# Altium schematic sheet Sheet1.SchDoc
size A2
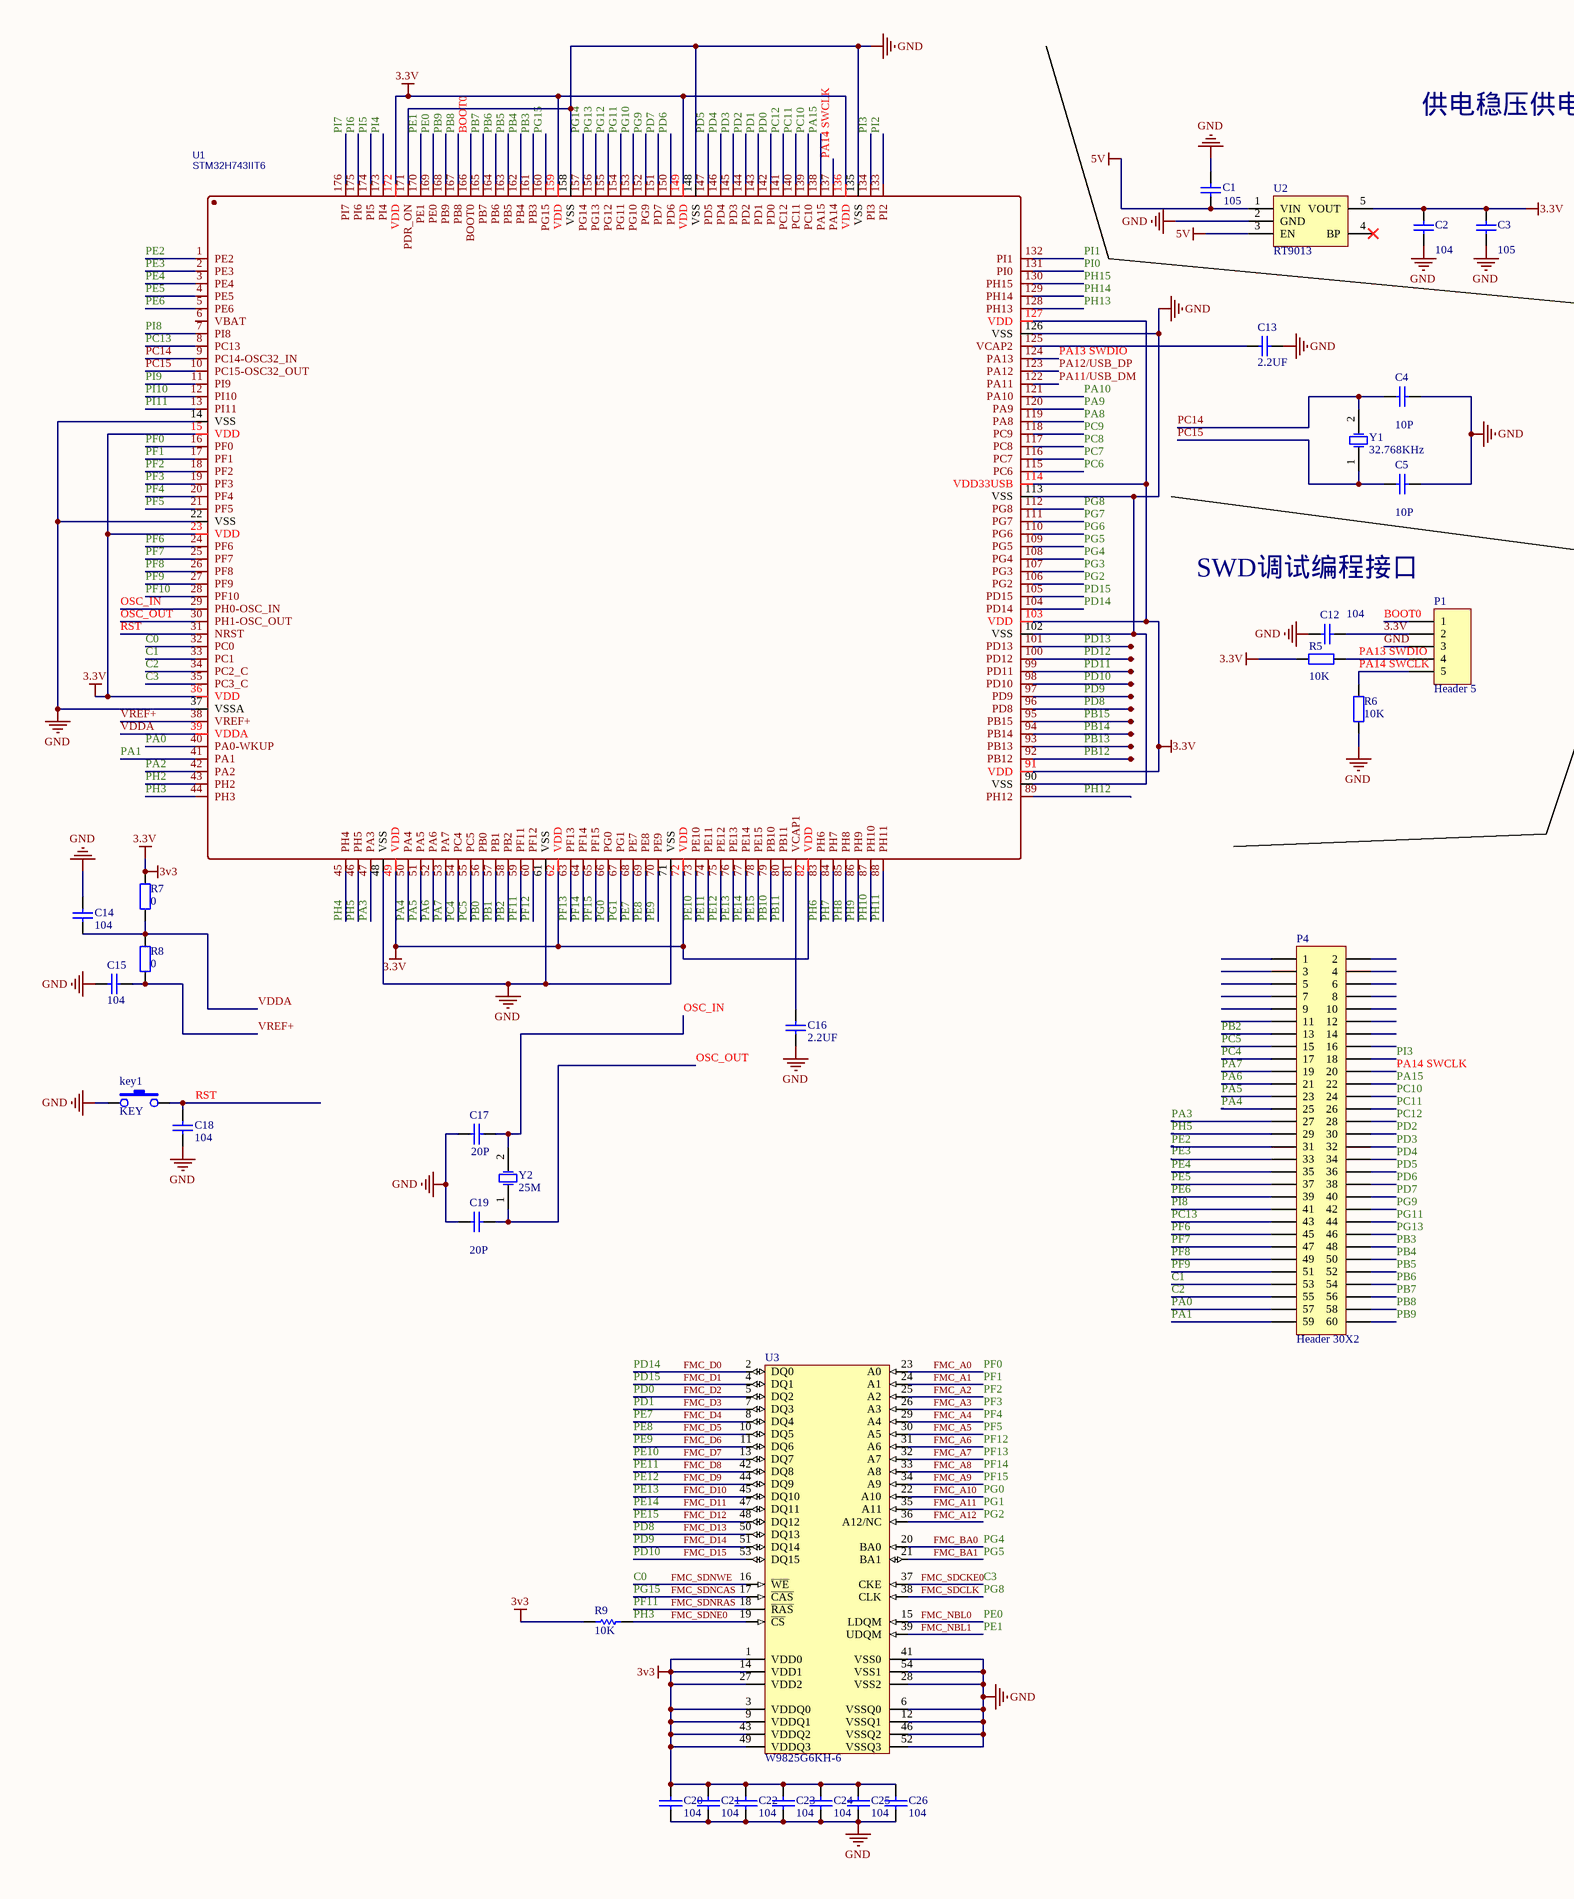
[diagram p0: Sheet1.SchDoc, left]
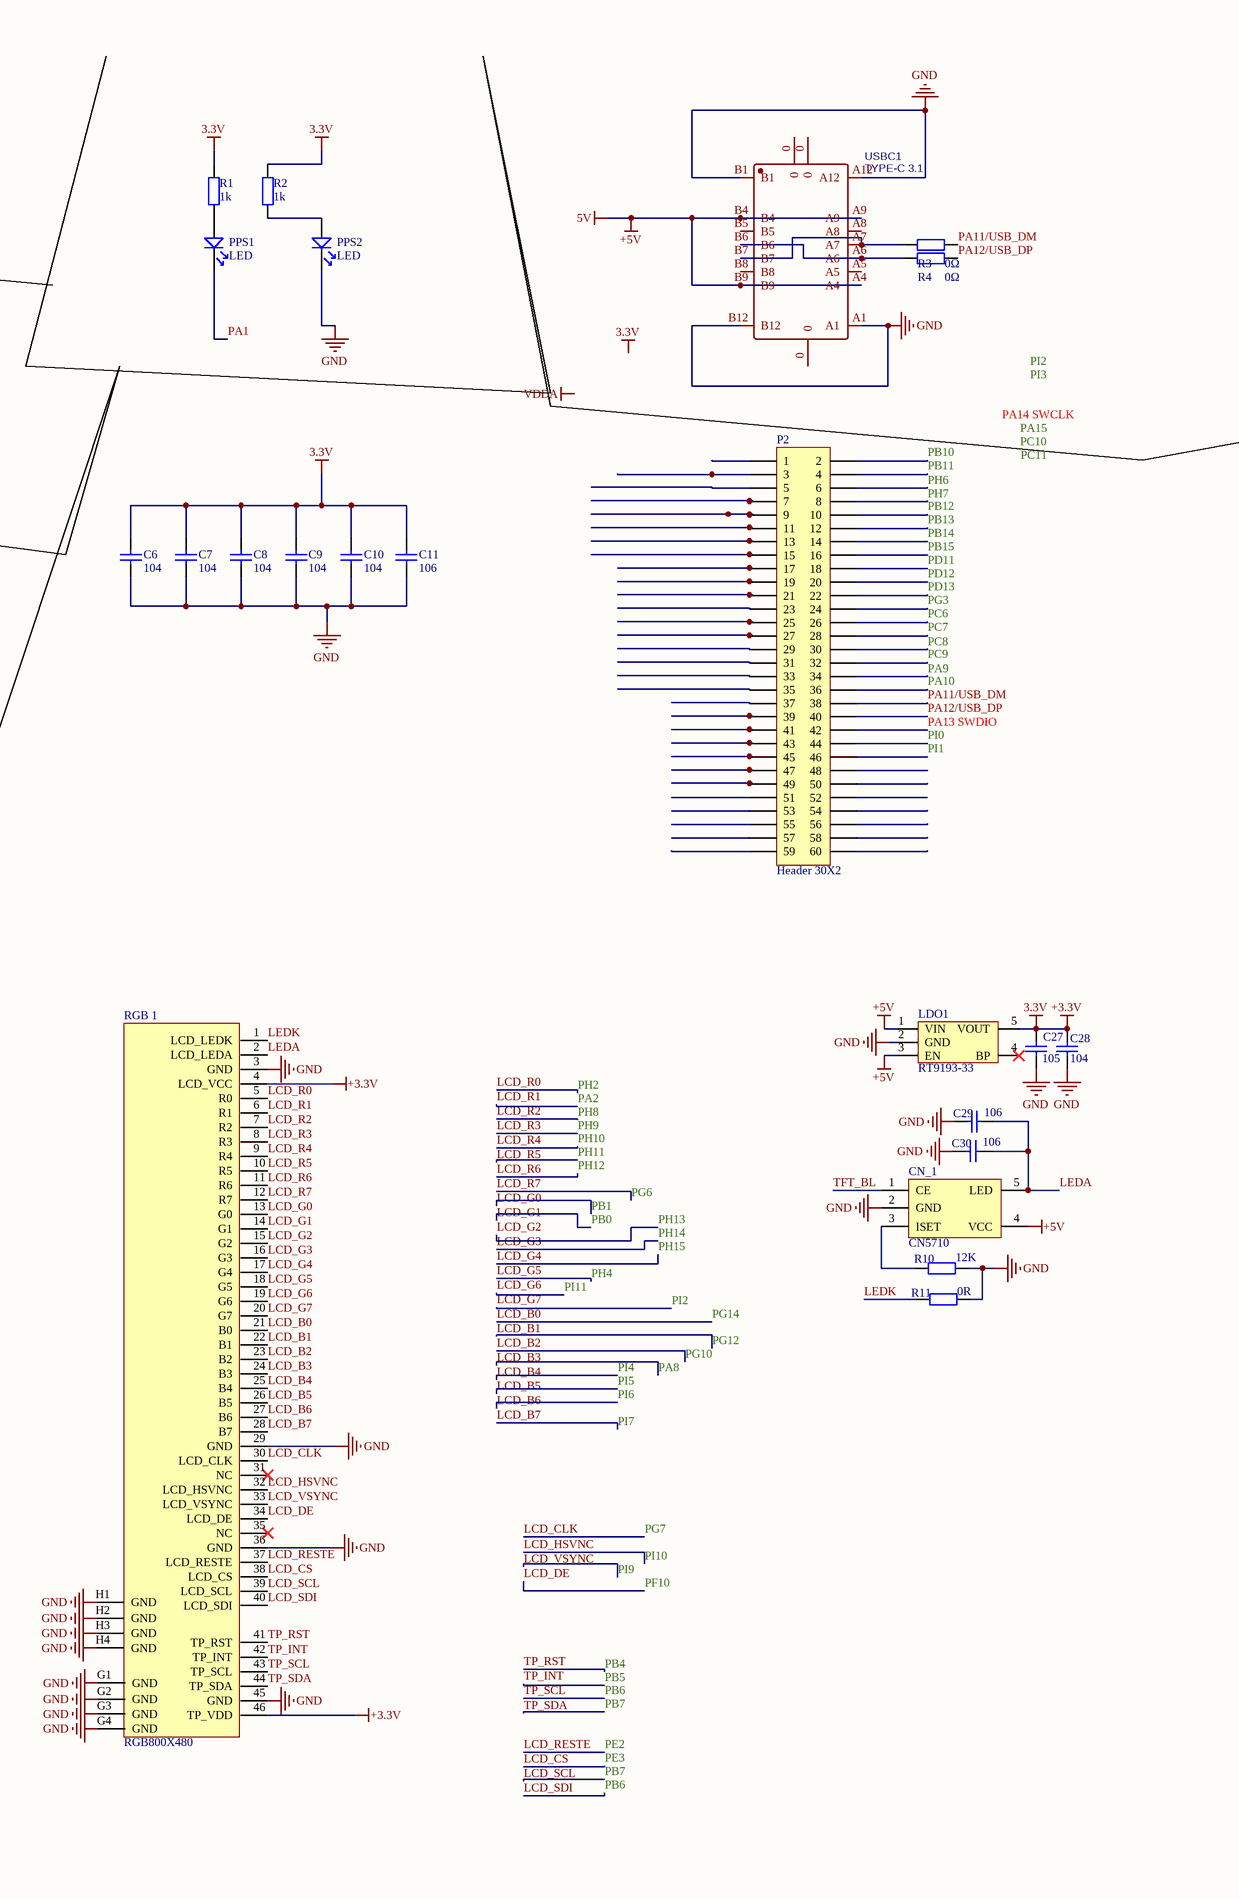
[diagram p1: Sheet1.SchDoc, right]

## Parts
C1  value 105  [0805C]  (hidden comment: Cap Semi)
C2  value 104  [0805C]  (hidden comment: Cap Semi)
C3  value 105  [0805C]  (hidden comment: Cap Semi)
C4  value 10P  [0805C]
C5  value 10P  [0805C]
C6  value 104  [0805C]
C7  value 104  [0805C]
C8  value 104  [0805C]
C9  value 104  [0805C]
C10  value 104  [0805C]
C11  value 106  [0805C]
C12  value 104  [0805C]
C13  value 2.2UF  [0805C]
C14  value 104  [0805C]
C15  value 104  [0805C]
C16  value 2.2UF  [0805C]
C17  value 20P  [0805C]
C18  value 104  [0805C]
C19  value 20P  [0805C]
C20  104  [0805C]
C21  104  [0805C]
C22  104  [0805C]
C23  104  [0805C]
C24  104  [0805C]
C25  104  [0805C]
C26  104  [0805C]
C27  105  [0805C]
C28  104  [0805C]
C29  106  [0805C]
C30  106  [0805C]
CN_1  CN5710  [LC-SOT-89-5]
key1  KEY  [TSW 3*6*4.3-S-W]
LDO1  RT9193-33  [SOT-23-5]
P1  Header 5  [HDR2.54-WS-5P]
P2  Header 30X2  [BTB60]
P4  Header 30X2  [BTB60]
PPS1  LED  [LED 0805G]
PPS2  LED  [LED 0805G]
R1  1k  [0805R]
R2  1k  [0805R]
R3  0Ω  [0805R]
R4  0Ω  [0805R]
R5  10K  [0805R]
R6  10K  [0805R]
R7  0  [0805R]
R8  0  [0805R]
R9  10K  [0805R]
R10  12K  [0805R]
R11  0R  [0805R]
RGB_1  RGB800X480  [RGB_800x480]
U1  STM32H743IIT6  [LQFP176 24x24_M]
U2  RT9013  [SOT23-5]
U3  W9825G6KH-6  [SOP80P1176X120-54N]
USBC1  TYPE-C 3.1  [TYPE-C-USB-17]
Y1  32.768KHz  [OSC 3215-2P]
Y2  25M  [OSC 5032-2P]

## Nets
3.3V: C2.2 C3.2 C6.1 C7.1 C8.1 C9.1 C10.1 C11.1 C12.1 C20.2 C21.2 C22.2 C23.2 C24.2 C25.2 C26.2 C27.2 C28.2 LDO1.5(VOUT) P1.2 R1.2 R2.2 R5.1 R7.1 R9.1 RGB_1.4(LCD_VCC) RGB_1.46(TP_VDD) U1.15(VDD) U1.23(VDD) U1.36(VDD) U1.49(VDD) U1.62(VDD) U1.72(VDD) U1.82(VDD) U1.91(VDD) U1.103(VDD) U1.114(VDD33USB) U1.127(VDD) U1.136(VDD) U1.149(VDD) U1.159(VDD) U1.172(VDD) U2.5(VOUT) U3.1(VDD0) U3.3(VDDQ0) U3.9(VDDQ1) U3.14(VDD1) U3.27(VDD2) U3.43(VDDQ2) U3.49(VDDQ3)  [also labelled +3.3V, 3v3]
+5V: C1.1 CN_1.4(VCC) LDO1.1(VIN) LDO1.3(EN) U2.1(VIN) U2.3(EN) USBC1.A4 USBC1.A9 USBC1.B4 USBC1.B9  [also labelled 5V]
GND: C1.2 C2.1 C3.1 C4.1 C5.1 C6.2 C7.2 C8.2 C9.2 C10.2 C11.2 C12.2 C13.2 C14.1 C15.2 C16.2 C17.2 C18.1 C19.2 C20.1 C21.1 C22.1 C23.1 C24.1 C25.1 C26.1 C27.1 C28.1 C29.2 C30.2 CN_1.2(GND) key1.1 LDO1.2(GND) P1.3 PPS2.2 R6.1 R10.1 R11.2 RGB_1.3(GND) RGB_1.29(GND) RGB_1.36(GND) RGB_1.45(GND) RGB_1.G1(GND) RGB_1.G2(GND) RGB_1.G3(GND) RGB_1.G4(GND) RGB_1.H1(GND) RGB_1.H2(GND) RGB_1.H3(GND) RGB_1.H4(GND) U1.14(VSS) U1.22(VSS) U1.37(VSSA) U1.48(VSS) U1.61(VSS) U1.71(VSS) U1.90(VSS) U1.102(VSS) U1.113(VSS) U1.126(VSS) U1.135(VSS) U1.148(VSS) U1.158(VSS) U1.171(PDR_ON) U2.2(GND) U3.6(VSSQ0) U3.12(VSSQ1) U3.28(VSS2) U3.41(VSS0) U3.46(VSSQ2) U3.52(VSSQ3) U3.54(VSS1) USBC1.A1 USBC1.A12 USBC1.B1 USBC1.B12
VDDA: C14.2 R7.2 R8.1 U1.39(VDDA)
BOOT0: P1.1 U1.166(BOOT0)
C0: U1.32(PC0) U3.16(~{WE})  [also labelled FMC_SDNWE]
C1: P4.53 U1.33(PC1)
C2: P4.55 U1.34(PC2_C)
C3: U1.35(PC3_C) U3.37(CKE)  [also labelled FMC_SDCKE0]
FMC_A0: U1.16(PF0) U3.23(A0)  [also labelled PF0]
FMC_A1: U1.17(PF1) U3.24(A1)  [also labelled PF1]
FMC_A2: U1.18(PF2) U3.25(A2)  [also labelled PF2]
FMC_A3: U1.19(PF3) U3.26(A3)  [also labelled PF3]
FMC_A4: U1.20(PF4) U3.29(A4)  [also labelled PF4]
FMC_A5: U1.21(PF5) U3.30(A5)  [also labelled PF5]
FMC_A6: U1.60(PF12) U3.31(A6)  [also labelled PF12]
FMC_A7: U1.63(PF13) U3.32(A7)  [also labelled PF13]
FMC_A8: U1.64(PF14) U3.33(A8)  [also labelled PF14]
FMC_A9: U1.65(PF15) U3.34(A9)  [also labelled PF15]
FMC_A10: U1.66(PG0) U3.22(A10)  [also labelled PG0]
FMC_A11: U1.67(PG1) U3.35(A11)  [also labelled PG1]
FMC_A12: U1.106(PG2) U3.36(A12/NC)  [also labelled PG2]
FMC_BA0: U1.108(PG4) U3.20(BA0)  [also labelled PG4]
FMC_BA1: U1.109(PG5) U3.21(BA1)  [also labelled PG5]
FMC_D0: U1.104(PD14) U3.2(DQ0)  [also labelled PD14]
FMC_D1: U1.105(PD15) U3.4(DQ1)  [also labelled PD15]
FMC_D2: U1.142(PD0) U3.5(DQ2)  [also labelled PD0]
FMC_D3: U1.143(PD1) U3.7(DQ3)  [also labelled PD1]
FMC_D4: U1.68(PE7) U3.8(DQ4)  [also labelled PE7]
FMC_D5: U1.69(PE8) U3.10(DQ5)  [also labelled PE8]
FMC_D6: U1.70(PE9) U3.11(DQ6)  [also labelled PE9]
FMC_D7: U1.73(PE10) U3.13(DQ7)  [also labelled PE10]
FMC_D8: U1.74(PE11) U3.42(DQ8)  [also labelled PE11]
FMC_D9: U1.75(PE12) U3.44(DQ9)  [also labelled PE12]
FMC_D10: U1.76(PE13) U3.45(DQ10)  [also labelled PE13]
FMC_D11: U1.77(PE14) U3.47(DQ11)  [also labelled PE14]
FMC_D12: U1.78(PE15) U3.48(DQ12)  [also labelled PE15]
FMC_D13: U1.96(PD8) U3.50(DQ13)  [also labelled PD8]
FMC_D14: U1.97(PD9) U3.51(DQ14)  [also labelled PD9]
FMC_D15: U1.98(PD10) U3.53(DQ15)  [also labelled PD10]
FMC_NBL0: U1.169(PE0) U3.15(LDQM)  [also labelled PE0]
FMC_NBL1: U1.170(PE1) U3.39(UDQM)  [also labelled PE1]
FMC_SDCLK: U1.112(PG8) U3.38(CLK)  [also labelled PG8]
FMC_SDNCAS: U1.160(PG15) U3.17(~{CAS})  [also labelled PG15]
FMC_SDNE0: R9.2 U1.44(PH3) U3.19(~{CS})  [also labelled PH3]
FMC_SDNRAS: U1.59(PF11) U3.18(~{RAS})  [also labelled PF11]
LCD_B0: RGB_1.21(B0) U1.157(PG14)  [also labelled PG14]
LCD_B1: RGB_1.22(B1) U1.155(PG12)  [also labelled PG12]
LCD_B2: RGB_1.23(B2) U1.153(PG10)  [also labelled PG10]
LCD_B3: RGB_1.24(B3) U1.119(PA8)  [also labelled PA8]
LCD_B4: RGB_1.25(B4) U1.173(PI4)  [also labelled PI4]
LCD_B5: RGB_1.26(B5) U1.174(PI5)  [also labelled PI5]
LCD_B6: RGB_1.27(B6) U1.175(PI6)  [also labelled PI6]
LCD_B7: RGB_1.28(B7) U1.176(PI7)  [also labelled PI7]
LCD_CLK: RGB_1.30(LCD_CLK) U1.111(PG7)  [also labelled PG7]
LCD_CS: P4.33 RGB_1.38(LCD_CS) U1.2(PE3)  [also labelled PE3]
LCD_DE: RGB_1.34(LCD_DE) U1.28(PF10)  [also labelled PF10]
LCD_G0: RGB_1.13(G0) U1.57(PB1)  [also labelled PB1]
LCD_G1: RGB_1.14(G1) U1.56(PB0)  [also labelled PB0]
LCD_G2: RGB_1.15(G2) U1.128(PH13)  [also labelled PH13]
LCD_G3: RGB_1.16(G3) U1.129(PH14)  [also labelled PH14]
LCD_G4: RGB_1.17(G4) U1.130(PH15)  [also labelled PH15]
LCD_G5: RGB_1.18(G5) U1.45(PH4)  [also labelled PH4]
LCD_G6: RGB_1.19(G6) U1.13(PI11)  [also labelled PI11]
LCD_G7: RGB_1.20(G7) U1.133(PI2)  [also labelled PI2]
LCD_HSVNC: RGB_1.32(LCD_HSVNC) U1.12(PI10)  [also labelled PI10]
LCD_R0: RGB_1.5(R0) U1.43(PH2)  [also labelled PH2]
LCD_R1: RGB_1.6(R1) U1.42(PA2)  [also labelled PA2]
LCD_R2: RGB_1.7(R2) U1.85(PH8)  [also labelled PH8]
LCD_R3: RGB_1.8(R3) U1.86(PH9)  [also labelled PH9]
LCD_R4: RGB_1.9(R4) U1.87(PH10)  [also labelled PH10]
LCD_R5: RGB_1.10(R5) U1.88(PH11)  [also labelled PH11]
LCD_R6: RGB_1.11(R6) U1.89(PH12)  [also labelled PH12]
LCD_R7: RGB_1.12(R7) U1.110(PG6)  [also labelled PG6]
LCD_RESTE: P4.31 RGB_1.37(LCD_RESTE) U1.1(PE2)  [also labelled PE2]
LCD_SCL: P4.56 RGB_1.39(LCD_SCL) RGB_1.44(TP_SDA) U1.165(PB7)  [also labelled PB7, TP_SDA]
LCD_SDI: P4.54 RGB_1.40(LCD_SDI) RGB_1.43(TP_SCL) U1.164(PB6)  [also labelled PB6, TP_SCL]
LCD_VSYNC: RGB_1.33(LCD_VSYNC) U1.11(PI9)  [also labelled PI9]
LEDA: C29.1 C30.1 CN_1.5(LED) RGB_1.2(LCD_LEDA)
LEDK: R11.1 RGB_1.1(LCD_LEDK)
OSC_IN: C17.1 U1.29(PH0-OSC_IN) Y2.2(OSC2)
OSC_OUT: C19.1 U1.30(PH1-OSC_OUT) Y2.1(OSC1)
PA0: P4.57 U1.40(PA0-WKUP)
PA1: P4.59 PPS1.2 U1.41(PA1)
PA3: P4.27 U1.47(PA3)
PA4: P4.25 U1.50(PA4)
PA5: P4.23 U1.51(PA5)
PA6: P4.21 U1.52(PA6)
PA7: P4.19 U1.53(PA7)
PA9: P2.34 U1.120(PA9)
PA10: P2.36 U1.121(PA10)
PA11/USB_DM: P2.38 R3.2 U1.122(PA11)
PA12/USB_DP: P2.40 R4.2 U1.123(PA12)
PA13 SWDIO: P1.4 P2.42 R5.2 U1.124(PA13)
PA14 SWCLK: P1.5 P4.20 R6.2 U1.137(PA14)
PA15: P4.22 U1.138(PA15)
PB2: P4.13 U1.58(PB2)
PB3: P4.48 U1.161(PB3)
PB4: P4.50 RGB_1.41(TP_RST) U1.162(PB4)  [also labelled TP_RST]
PB5: P4.52 RGB_1.42(TP_INT) U1.163(PB5)  [also labelled TP_INT]
PB8: P4.58 U1.167(PB8)
PB9: P4.60 U1.168(PB9)
PB10: P2.2 U1.79(PB10)
PB11: P2.4 U1.80(PB11)
PB12: P2.10 U1.92(PB12)
PB13: P2.12 U1.93(PB13)
PB14: P2.14 U1.94(PB14)
PB15: P2.16 U1.95(PB15)
PC4: P4.17 U1.54(PC4)
PC5: P4.15 U1.55(PC5)
PC6: P2.26 U1.115(PC6)
PC7: P2.28 U1.116(PC7)
PC8: P2.30 U1.117(PC8)
PC9: P2.32 U1.118(PC9)
PC10: P4.24 U1.139(PC10)
PC11: P4.26 U1.140(PC11)
PC12: P4.28 U1.141(PC12)
PC13: P4.43 U1.8(PC13)
PC14: C4.2 U1.9(PC14-OSC32_IN) Y1.2(OSC2)
PC15: C5.2 U1.10(PC15-OSC32_OUT) Y1.1(OSC1)
PD2: P4.30 U1.144(PD2)
PD3: P4.32 U1.145(PD3)
PD4: P4.34 U1.146(PD4)
PD5: P4.36 U1.147(PD5)
PD6: P4.38 U1.150(PD6)
PD7: P4.40 U1.151(PD7)
PD11: P2.18 U1.99(PD11)
PD12: P2.20 U1.100(PD12)
PD13: P2.22 U1.101(PD13)
PE4: P4.35 U1.3(PE4)
PE5: P4.37 U1.4(PE5)
PE6: P4.39 U1.5(PE6)
PF6: P4.45 U1.24(PF6)
PF7: P4.47 U1.25(PF7)
PF8: P4.49 U1.26(PF8)
PF9: P4.51 U1.27(PF9)
PG3: P2.24 U1.107(PG3)
PG9: P4.42 U1.152(PG9)
PG11: P4.44 U1.154(PG11)
PG13: P4.46 U1.156(PG13)
PH5: P4.29 U1.46(PH5)
PH6: P2.6 U1.83(PH6)
PH7: P2.8 U1.84(PH7)
PI0: P2.44 U1.131(PI0)
PI1: P2.46 U1.132(PI1)
PI3: P4.18 U1.134(PI3)
PI8: P4.41 U1.7(PI8)
RST: C18.2 key1.2 U1.31(NRST)
TFT_BL: CN_1.1(CE)
VREF+: C15.1 R8.2 U1.38(VREF+)
NetC13_1: C13.1 U1.125(VCAP2)
NetC16_1: C16.1 U1.81(VCAP1)
NetCN_1_3: CN_1.3(ISET) R10.2
NetPPS1_1: PPS1.1 R1.1
NetPPS2_1: PPS2.1 R2.1
NetR3_1: R3.1 USBC1.A7 USBC1.B7
NetR4_1: R4.1 USBC1.A6 USBC1.B6

Not connected (* = marked no-connect by the designer): LDO1 4(BP)*; P2 1 3 5 7 9 11 13 15 17 19 21 23 25 27 29 31 33 35 37 39 41 43 45 47 48 49 50 51 52 53 54 55 56 57 58 59 60; P4 1 2 3 4 5 6 7 8 9 10 11 12 14 16; RGB_1 31(NC)* 35(NC)*; U1 6(VBAT); U2 4(BP)*; USBC1 0 A5 A8 B5 B8

## Notes on the sheet
- 供电稳压供电
- SWD调试编程接口
- Labels drawn without touching a wire or pin: 3.3V, PA14 SWCLK, PA15, PC10, PC11, PI2, PI3, VDDA

## Library data of the parts
C1-C3 = Cap Semi: Capacitor (Semiconductor SIM Model); Published: 8-Jun-2000; LatestRevisionDate: 29-May-2009; LatestRevisionNote: IPC-7351 Footprint Added.; PackageReference: C1206; Publisher: Altium Limited; PackageDescription: Chip Capacitor
C4-C11 C13-C19 = Cap_1_1: Capacitor; Published: 8-Jun-2000; LatestRevisionDate: 17-Jul-2002; LatestRevisionNote: Re-released for DXP Platform.; PackageReference: RAD-0.3; Publisher: Altium Limited; PackageDescription: Radial Cap, Thru-Hole; 2 Leads; 0.3 in Pin Spacing
C12 = Cap_1_1: 104; Published: 8-Jun-2000; LatestRevisionDate: 17-Jul-2002; LatestRevisionNote: Re-released for DXP Platform.; PackageReference: RAD-0.3; Publisher: Altium Limited; PackageDescription: Radial Cap, Thru-Hole; 2 Leads; 0.3 in Pin Spacing
C20-C26 = CAP: 无极性电容
C27 C29 C30 = Cap: Capacitor; Value: 104; Published: 8-Jun-2000; LatestRevisionDate: 17-Jul-2002; LatestRevisionNote: Re-released for DXP Platform.; Publisher: Altium Limited
C28 = Cap: Capacitor; Published: 8-Jun-2000; LatestRevisionDate: 17-Jul-2002; LatestRevisionNote: Re-released for DXP Platform.; Publisher: Altium Limited; Value: 104
LDO1 = RT9193-33: 3.3V超低压差LDO
P1 = Header 5: Header, 5-Pin; LatestRevisionDate: *; LatestRevisionNote: *; Publisher: *
P2 P4 = Header 30X2: Header, 30-Pin, Dual row; LatestRevisionDate: 17-Jul-2002; LatestRevisionNote: Re-released for DXP Platform.; Publisher: Altium Limited
R1-R8 = RES: Resistor; Published: 8-Jun-2000; LatestRevisionDate: 17-Jul-2002; LatestRevisionNote: Re-released for DXP Platform.; PackageReference: AXIAL-0.4; Publisher: Altium Limited; PackageDescription: Axial Device, Thru-Hole; 2 Leads; 0.4 in Pin Spacing
R9 = RES
R10 R11 = Res2: Resistor; Published: 8-Jun-2000; LatestRevisionDate: 17-Jul-2002; LatestRevisionNote: Re-released for DXP Platform.; Publisher: Altium Limited
RGB_1 = RGB_800X480
U1 = STM32H743IIT6: BOM_Manufacturer: STMicroelectronics; Contributor: LCSC; SMT Type: Extend; BOM_Supplier: LCSC; BOM_Supplier Part: C89597; BOM_Manufacturer Part: STM32H743IIT6; BOM_LCSC Assembly: Yes; spicePre: U; spiceSymbolName: STM32H743IIT6
U3 = IS42S16160B: 32MB SDRAM
Y1 Y2 = XTAL: Crystal Oscillator; Published: 8-Jun-2000; LatestRevisionDate: 17-Jul-2002; LatestRevisionNote: Re-released for DXP Platform.; Publisher: Altium Limited